# Altium schematic sheet 输出板.SchDoc
size A4; Date: 2011.10.28; : 8通道刺激输出板; DrawnBy: Phoenix Joe; Engineer: Phoenix Joe; : 8通道刺激输出板
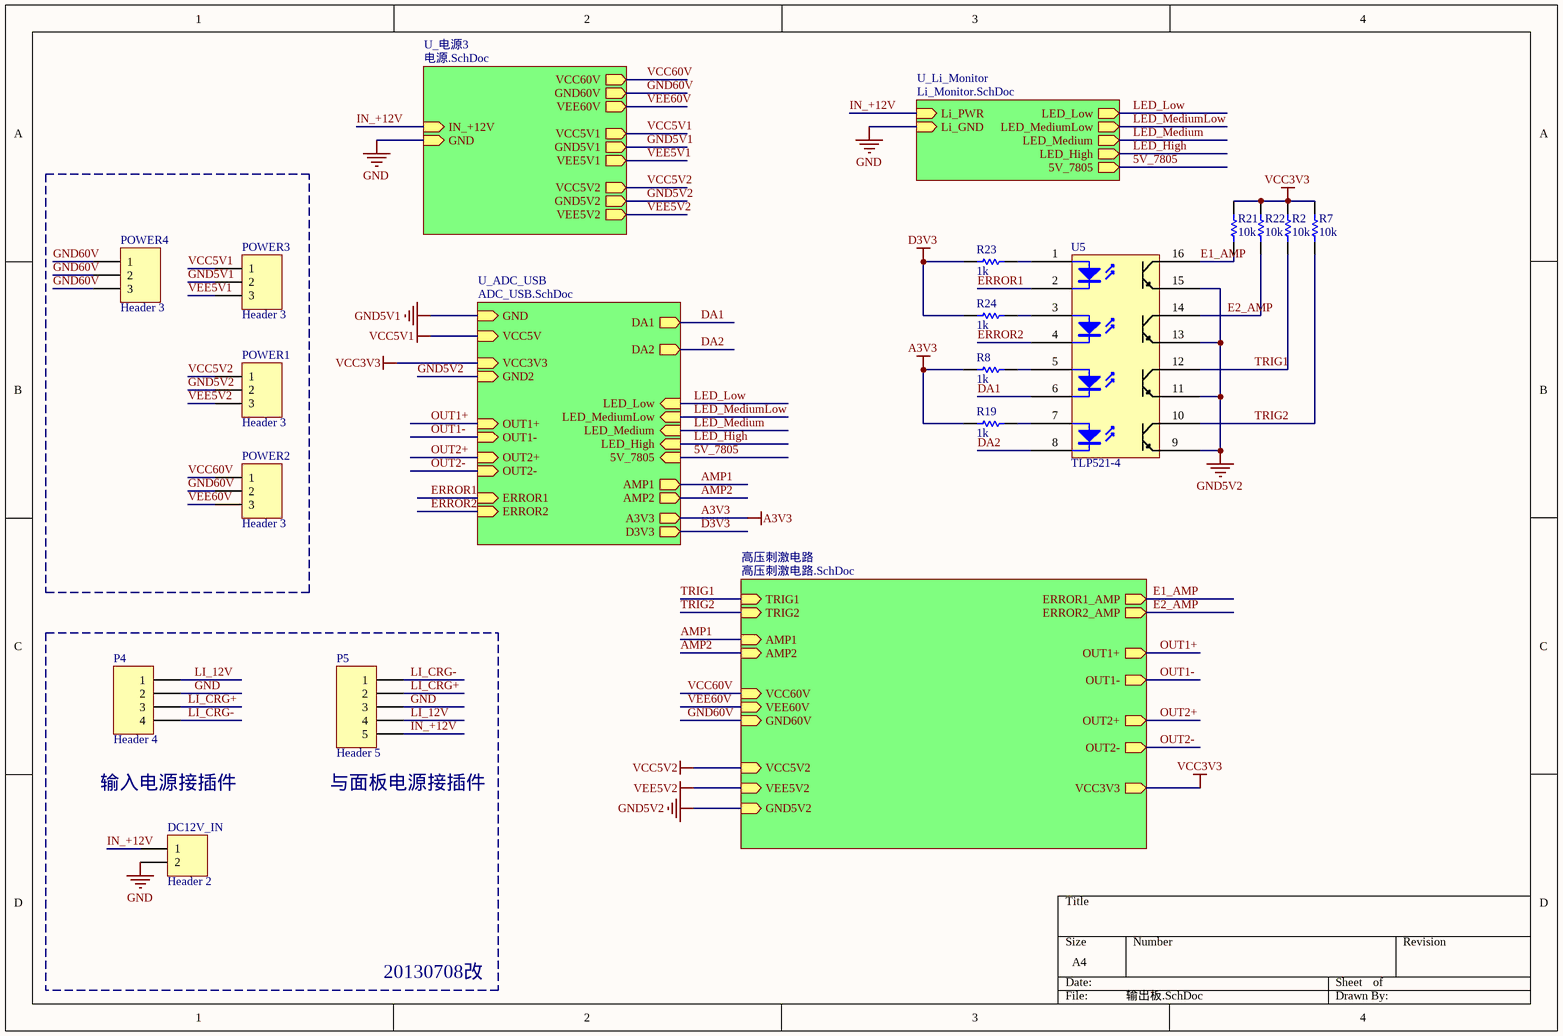
[diagram p0: 输出板.SchDoc]

## Parts
DC12V_IN  Header 2  [HDR1X2]
P4  Header 4  [Power-4P]
P5  Header 5  [Power-5P]
POWER1  Header 3  [HDR1X3]
POWER2  Header 3  [HDR1X3]
POWER3  Header 3  [HDR1X3]
POWER4  Header 3  [HDR1X3]
R2  10k  [R0603]
R7  10k  [R0603]
R8  1k  [R0603]
R19  1k  [R0603]
R21  10k  [R0603]
R22  10k  [R0603]
R23  1k  [R0603]
R24  1k  [R0603]
U5  TLP521-4  [DIP-16]

## Sub-sheets
U_ADC_USB = ADC_USB.SchDoc: GND (in), VCC5V (in), DA1 (out), DA2 (out), OUT1+ (in), OUT1- (in), OUT2+ (in), OUT2- (in), LED_Low (in), LED_MediumLow (in), LED_Medium (in), LED_High (in), 5V_7805 (in), VCC3V3 (in), GND2 (in), AMP1 (out), AMP2 (out), A3V3 (out), ERROR1 (in), ERROR2 (in), D3V3 (out)
U_Li_Monitor = Li_Monitor.SchDoc: LED_Low (out), LED_MediumLow (out), LED_Medium (out), LED_High (out), 5V_7805 (out), Li_PWR (in), Li_GND (in)
U_电源3 = 电源.SchDoc: IN_+12V (in), VCC60V (out), VEE60V (out), VCC5V1 (out), VEE5V1 (out), GND60V (out), GND5V1 (out), VCC5V2 (out), VEE5V2 (out), GND5V2 (out), GND (in)
高压刺激电路 = 高压刺激电路.SchDoc: TRIG1 (in), VCC60V (in), VEE60V (in), GND60V (in), VCC5V2 (in), VEE5V2 (in), OUT1+ (out), GND5V2 (in), OUT1- (out), OUT2+ (out), OUT2- (out), TRIG2 (in), AMP1 (in), AMP2 (in), VCC3V3 (out), ERROR1_AMP (out), ERROR2_AMP (out)

## Nets
A3V3: R8.1 R19.1 ; sheet U_ADC_USB/A3V3
D3V3: R23.1 R24.1 ; sheet U_ADC_USB/D3V3
GND: DC12V_IN.2 P4.2 P5.3 ; sheet U_电源3/GND, sheet U_Li_Monitor/Li_GND
GND5V1: POWER3.2 ; sheet U_电源3/GND5V1, sheet U_ADC_USB/GND
GND5V2: POWER1.2 U5.9 U5.11 U5.13 U5.15 ; sheet 高压刺激电路/GND5V2, sheet U_电源3/GND5V2, sheet U_ADC_USB/GND2
VCC3V3: R2.1 R7.2 R21.1 R22.2 ; sheet 高压刺激电路/VCC3V3, sheet U_ADC_USB/VCC3V3
VCC5V1: POWER3.1 ; sheet U_电源3/VCC5V1, sheet U_ADC_USB/VCC5V
VCC5V2: POWER1.1 ; sheet 高压刺激电路/VCC5V2, sheet U_电源3/VCC5V2
VEE5V2: POWER1.3 ; sheet 高压刺激电路/VEE5V2, sheet U_电源3/VEE5V2
5V_7805: sheet U_ADC_USB/5V_7805, sheet U_Li_Monitor/5V_7805
AMP1: sheet 高压刺激电路/AMP1, sheet U_ADC_USB/AMP1
AMP2: sheet 高压刺激电路/AMP2, sheet U_ADC_USB/AMP2
DA1: U5.6 ; sheet U_ADC_USB/DA1
DA2: U5.8 ; sheet U_ADC_USB/DA2
E1_AMP: R21.2 U5.16 ; sheet 高压刺激电路/ERROR1_AMP
E2_AMP: R22.1 U5.14 ; sheet 高压刺激电路/ERROR2_AMP
ERROR1: U5.2 ; sheet U_ADC_USB/ERROR1
ERROR2: U5.4 ; sheet U_ADC_USB/ERROR2
GND60V: POWER2.2 POWER4.1 POWER4.2 POWER4.3 ; sheet 高压刺激电路/GND60V, sheet U_电源3/GND60V
IN_+12V: DC12V_IN.1 P5.5 ; sheet U_电源3/IN_+12V, sheet U_Li_Monitor/Li_PWR
LED_High: sheet U_ADC_USB/LED_High, sheet U_Li_Monitor/LED_High
LED_Low: sheet U_ADC_USB/LED_Low, sheet U_Li_Monitor/LED_Low
LED_Medium: sheet U_ADC_USB/LED_Medium, sheet U_Li_Monitor/LED_Medium
LED_MediumLow: sheet U_ADC_USB/LED_MediumLow, sheet U_Li_Monitor/LED_MediumLow
LI_12V: P4.1 P5.4
LI_CRG+: P4.3 P5.2
LI_CRG-: P4.4 P5.1
OUT1+: sheet 高压刺激电路/OUT1+, sheet U_ADC_USB/OUT1+
OUT1-: sheet 高压刺激电路/OUT1-, sheet U_ADC_USB/OUT1-
OUT2+: sheet 高压刺激电路/OUT2+, sheet U_ADC_USB/OUT2+
OUT2-: sheet 高压刺激电路/OUT2-, sheet U_ADC_USB/OUT2-
TRIG1: R2.2 U5.12 ; sheet 高压刺激电路/TRIG1
TRIG2: R7.1 U5.10 ; sheet 高压刺激电路/TRIG2
VCC60V: POWER2.1 ; sheet 高压刺激电路/VCC60V, sheet U_电源3/VCC60V
VEE5V1: POWER3.3 ; sheet U_电源3/VEE5V1
VEE60V: POWER2.3 ; sheet 高压刺激电路/VEE60V, sheet U_电源3/VEE60V
NetR8_2: R8.2 U5.5
NetR19_2: R19.2 U5.7
NetR23_2: R23.2 U5.1
NetR24_2: R24.2 U5.3

## Notes on the sheet
- 输入电源接插件
- (near P5) 与面板电源接插件
- 20130708改

## Library data of the parts
DC12V_IN = Header 2: Header, 2-Pin; LatestRevisionDate: 17-Jul-2002; LatestRevisionNote: Re-released for DXP Platform.; Publisher: Altium Limited
P4 = Header 4: Header, 4-Pin; LatestRevisionDate: 17-Jul-2002; LatestRevisionNote: Re-released for DXP Platform.; Publisher: Altium Limited
P5 = Header 5: Header, 5-Pin; LatestRevisionDate: 17-Jul-2002; LatestRevisionNote: Re-released for DXP Platform.; Publisher: Altium Limited
POWER1-POWER4 = Header 3: Header, 3-Pin; LatestRevisionDate: 17-Jul-2002; LatestRevisionNote: Re-released for DXP Platform.; Publisher: Altium Limited
R2 R7 R21 R22 = Res1: Resistor; Value: 1K; Published: 8-Jun-2000; LatestRevisionDate: 17-Jul-2002; LatestRevisionNote: Re-released for DXP Platform.; PackageReference: AXIAL-0.3; Publisher: Altium Limited; PackageDescription: Axial Device, Thru-Hole; 2 Leads; 0.3 in Pin Spacing
R8 R19 R23 R24 = Res1: Resistor; Published: 8-Jun-2000; LatestRevisionDate: 17-Jul-2002; LatestRevisionNote: Re-released for DXP Platform.; PackageReference: AXIAL-0.3; Publisher: Altium Limited; PackageDescription: Axial Device, Thru-Hole; 2 Leads; 0.3 in Pin Spacing
  R8 R23 R24: 15k: 1K
  R19: Value: 1K